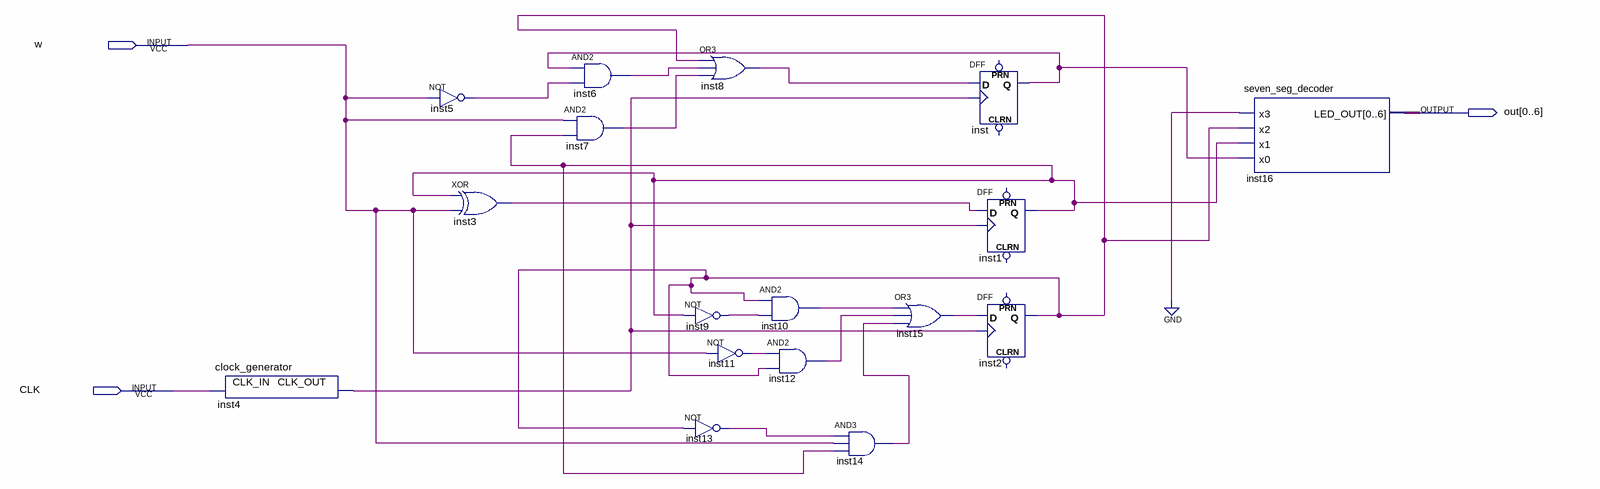
[diagram p0: schematic sheet]
// Quartus schematic lab11step2.bdf as structural Verilog: 17 symbols, 3 pins
module lab11step2 (
  input  w,
  input  CLK,
  output [0:6] out
);

  wire inst1_q, inst2_q, inst3_out, inst4_clk_out, inst5_out, inst6_out, inst7_out, inst8_out, inst9_out,
       inst10_out, inst11_out, inst12_out, inst13_out, inst14_out, inst15_out, inst_q;

  clock_generator inst4 (.CLK_IN(CLK), .CLK_OUT(inst4_clk_out));
  not inst5 (inst5_out, w);
  xor inst3 (inst3_out, inst1_q, w);
  and inst6 (inst6_out, inst_q, inst5_out);
  and inst7 (inst7_out, w, inst1_q);
  or inst8 (inst8_out, inst2_q, inst6_out, inst7_out);
  not inst9 (inst9_out, inst1_q);
  not inst11 (inst11_out, w);
  not inst13 (inst13_out, inst2_q);
  and inst10 (inst10_out, inst2_q, inst9_out);
  and inst12 (inst12_out, inst11_out, inst2_q);
  and inst14 (inst14_out, inst13_out, w, inst1_q);
  or inst15 (inst15_out, inst10_out, inst12_out, inst14_out);
  DFF inst (.CLK(inst4_clk_out), .D(inst8_out), .Q(inst_q));  // open: CLRN, PRN
  DFF inst1 (.CLK(inst4_clk_out), .D(inst3_out), .Q(inst1_q));  // open: CLRN, PRN
  DFF inst2 (.CLK(inst4_clk_out), .D(inst15_out), .Q(inst2_q));  // open: CLRN, PRN
  seven_seg_decoder inst16 (.x3(1'b0), .x2(inst2_q), .x1(inst1_q), .x0(inst_q), .LED_OUT(out));
endmodule
